# Altium schematic sheet E_Switch.SchDoc
size A3
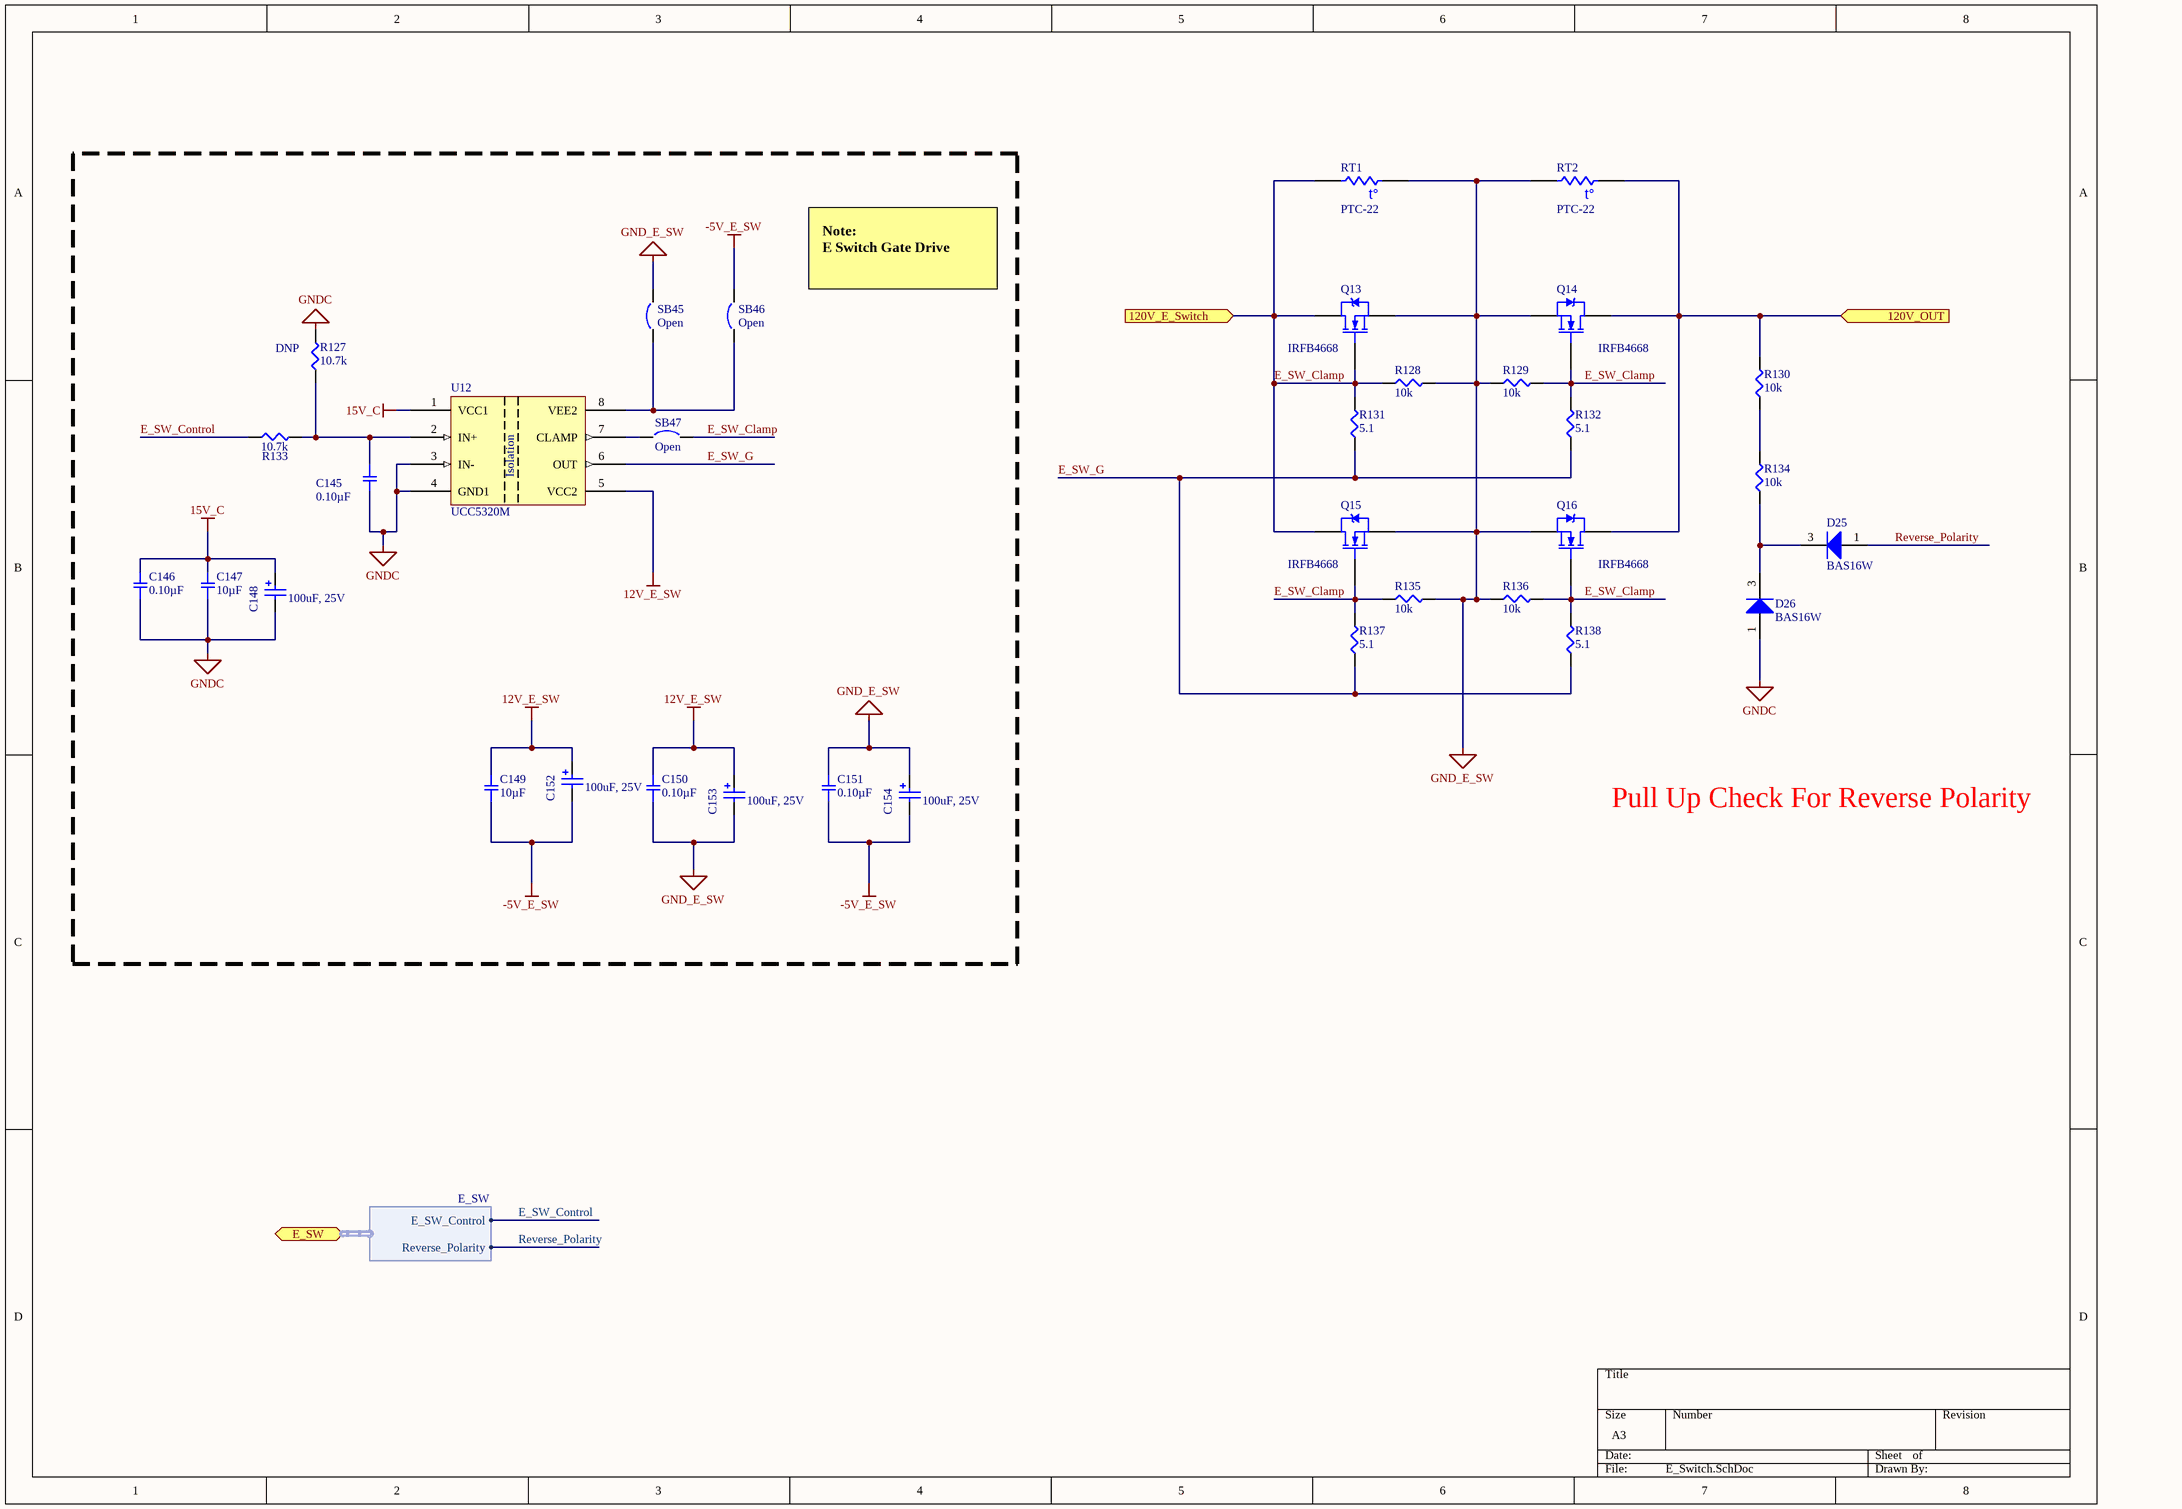
[diagram p0: E_Switch.SchDoc]

## Parts
C145  0.10µF  [SMD-0603C]
C146  0.10µF  [SMD-0805C]
C147  10µF  [SMD-0805C]
C148  100uF, 25V  [WCAP-ASLL_6.3x7.7]
C149  10µF  [SMD-0805C]
C150  0.10µF  [SMD-0805C]
C151  0.10µF  [SMD-0805C]
C152  100uF, 25V  [WCAP-ASLL_6.3x7.7]
C153  100uF, 25V  [WCAP-ASLL_6.3x7.7]
C154  100uF, 25V  [WCAP-ASLL_6.3x7.7]
D25  BAS16W  [SOT95P278X110-3N]
D26  BAS16W  [SOT95P278X110-3N]
Q13  IRFB4668  [TO-220AB]
Q14  IRFB4668  [TO-220AB]
Q15  IRFB4668  [TO-220AB]
Q16  IRFB4668  [TO-220AB]
R127  10.7k  [SMD-0603-RES]
R128  10k  [SMD-1206-RES]
R129  10k  [SMD-1206-RES]
R130  10k  [SMD-1206-RES]
R131  5.1  [SMD-1206-RES]
R132  5.1  [SMD-1206-RES]
R133  10.7k  [SMD-0603-RES]
R134  10k  [SMD-1206-RES]
R135  10k  [SMD-1206-RES]
R136  10k  [SMD-1206-RES]
R137  5.1  [SMD-1206-RES]
R138  5.1  [SMD-1206-RES]
RT1  PTC-22  [PTCEL-17R]
RT2  PTC-22  [PTCEL-17R]
SB45  Open  [Solder Bridge - HP]  (no BOM)
SB46  Open  [Solder Bridge - HP]  (no BOM)
SB47  Open  [Solder Bridge - HP]  (no BOM)
U12  UCC5320M  [SOIC127P570X175_HS-9N]

## Blocks framed on the sheet
DNP: C145-C154 R127 R133 SB45-SB47 U12

## Ports
120V_E_Switch (in), 120V_OUT (in), E_SW (bidir, harness E_SW)

## Harnesses
E_SW: E_SW_Control, Reverse_Polarity

## Nets
12V_E_SW: C149.2 C150.2 C152.2(P) C153.2(P) U12.5(VCC2)
15V_C: C146.2 C147.2 C148.2(P) U12.1(VCC1)
-5V_E_SW: C149.1 C151.1 C152.1(N) C154.1(N) SB46.2
GND_E_SW: C150.1 C151.2 C153.1(N) C154.2(P) Q13.3(S) Q14.3(S) Q15.3(S) Q16.3(S) R128.2 R129.1 R135.2 R136.1 RT1.1 RT2.2 SB45.2
GNDC: C145.2 C146.1 C147.1 C148.1(N) D26.1(A) R127.2 U12.3(IN-) U12.4(GND1)
120V_OUT: Q14.2(D) Q16.2(D) R130.2 RT2.1 ; port 120V_OUT
E_SW_Clamp: Q13.1(G) Q13.2(D) Q14.1(G) Q15.1(G) Q15.2(D) Q16.1(G) R128.1 R129.2 R131.2 R132.2 R135.1 R136.2 R137.2 R138.2 RT1.2 SB47.2 ; port 120V_E_Switch
E_SW_Control: R133.1 ; port E_SW.E_SW_Control
E_SW_G: R131.1 R132.1 R137.1 R138.1 U12.6(OUT)
Reverse_Polarity: D25.1(A) ; port E_SW.Reverse_Polarity
NetC145_1: C145.1 R127.1 R133.2 U12.2(IN+)
NetD25_3: D25.3(K) D26.3(K) R134.1
NetR130_1: R130.1 R134.2
NetSB45_1: SB45.1 SB46.1 U12.8(VEE2)
NetSB47_1: SB47.1 U12.7(CLAMP)

## Notes on the sheet
- Note:
  E Switch Gate Drive
- Pull Up Check For Reverse Polarity
- (in symbol Res Thermal) t°
- (in symbol UCC5320M) Isolation

## Library data of the parts
C145 = GCJ188R72A104KA01D: CAP CER 0.1UF 100V X7R 0603; Manufacturer: Murata Electronics North America; Factory Stock: 0; Unit Price (USD): 0.23; Minimum Quantity: 1; Tolerance: ±10%; Datasheets: http://www.murata.com/~/media/webrenewal/support/library/catalog/products/capacitor/mlcc/c03e.ashx; Image: //media.digikey.com/Renders/Murata%20Renders/0603%28LQG18%29.jpg; Digi-Key Part Number: 490-13420-1-ND; Part Number: GCJ188R72A104KA01D; Quantity Available: 2728; @ qty: 0; Packaging: Cut Tape (CT); Series: GCJ; Part Status: Active; Value: 0.10µF; Voltage: 100V; Temperature Coefficient: X7R; Operating Temperature: -55°C ~ 125°C; Features: Soft Termination; Ratings: AEC-Q200; Applications: Automotive, Boardflex Sensitive; Mounting Type: Surface Mount, MLCC; Package / Case: 0603 (1608 Metric); Size / Dimension: 0.063" L x 0.031" W (1.60mm x 0.80mm); Height - Seated (Max): -; Thickness (Max): 0.035" (0.90mm); Lead Spacing: -; Lead Style: -
C146 C150 C151 = GCD21BR71H104KA01L: CAP CER 0.1UF 50V X7R 0805; Manufacturer: Murata Electronics North America; Factory Stock: 0; Unit Price (USD): 0.24; Minimum Quantity: 1; Tolerance: ±10%; Datasheets: http://www.murata.com/~/media/webrenewal/support/library/catalog/products/capacitor/mlcc/c03e.ashx; Image: //media.digikey.com/Renders/Murata%20Renders/0805%28GxM6%29.jpg; Digi-Key Part Number: 490-11955-1-ND; Part Number: GCD21BR71H104KA01L; Quantity Available: 157; @ qty: 0; Packaging: Cut Tape (CT); Series: GCD; Part Status: Active; Value: 0.10µF; Voltage: 50V; Temperature Coefficient: X7R; Operating Temperature: -55°C ~ 125°C; Features: -; Ratings: AEC-Q200; Applications: Automotive; Mounting Type: Surface Mount, MLCC; Package / Case: 0805 (2012 Metric); Size / Dimension: 0.079" L x 0.049" W (2.00mm x 1.25mm); Height - Seated (Max): -; Thickness (Max): 0.049" (1.25mm); Lead Spacing: -; Lead Style: -
C147 C149 = GRM21BC8YA106KE11L: CAP CER 10UF 35V X6S 0805; Manufacturer: Murata Electronics North America; Factory Stock: 0; Unit Price (USD): 0.33; Minimum Quantity: 1; Tolerance: ±10%; Datasheets: http://www.murata.com/~/media/webrenewal/support/library/catalog/products/capacitor/mlcc/c02e.pdf; Image: //media.digikey.com/Renders/Murata%20Renders/0805%20(2012%20Metric)%20.85mm.jpg; Digi-Key Part Number: 490-10504-1-ND; Part Number: GRM21BC8YA106KE11L; Quantity Available: 72253; @ qty: 0; Packaging: Cut Tape (CT); Series: GRM; Part Status: Active; Value: 10µF; Voltage: 35V; Temperature Coefficient: X6S; Operating Temperature: -55°C ~ 105°C; Features: Derating Recommended; Ratings: -; Applications: General Purpose; Mounting Type: Surface Mount, MLCC; Package / Case: 0805 (2012 Metric); Size / Dimension: 0.079" L x 0.049" W (2.00mm x 1.25mm); Height - Seated (Max): -; Thickness (Max): 0.057" (1.45mm); Lead Spacing: -; Lead Style: -
C148 C152-C154 = 865060445005: WCAP-ASLL SMT Aluminum Electrolytic Capacitors, D6.3mm x L7.7mm, 100uF, +/-20%, 25VDC; Dissipation Factor: 14%; Endurance: 2000h; Leakage Current: 25uA; Ripple Current max.: 300mA; Technical Reference: ASED077101M025DVCTCB000; ComponentLink1Description: Manufacturer; ComponentLink1URL: http://www.we-online.de; ComponentLink2Description: Datasheet; ComponentLink2URL: https://katalog.we-online.com/pbs/datasheet/865060445005.pdf; Length: 7.7mm; Mounting Technology: SMT; Operating Temperature: -55 to +105degC; Packaging: Tape and Reel; Published Date: August 2019; Capacitance: 100uF; Diameter: 6.3mm; Part Number: 865060445005; Publisher: Wurth Elektronik; Capacitance Tolerance: +/-20%; Rated Voltage: 25VDC
D25 D26 = BAS16: Silicon Switching Diode, SOT323, Reel, Green; Manufacturer: Infineon; IR (max): 100Â nA; Configuration: Single; VBR (min): 85Â V; VR (max): 80Â V; trr (max): 4Â ns; Green: TRUE; VF (max): 1.25Â V; IF (max): 250Â mA; Mounting Technology: Surface Mount; PackageReference: SOT323; ComponentLink2URL: http://www.infineon.com/dgdl/bas16series.pdf?folderId=db3a30431400ef6801141b5844e103ea&fileId=db3a30431400ef6801141b93811b03ff; Halogen-free: TRUE; ComponentLink2Description: Datasheet; PartNumber: BAS16W; ComponentLink1Description: Manufacturer URL; ComponentLink3URL: http://www.infineon.com/dgdl/SOT323-Package_Overview.pdf?folderId=db3a30431936bc4b0119533e1dcb3c92&fileId=db3a30431936bc4b011953495f283cb1; ComponentLink1URL: http://www.infineon.com/; PackageDescription: 3-Pin Small Outline Transistor Package, 1.25 x 2 mm Body, 0.65 mm Pitch; ComponentLink3Description: Package Specification
Q13-Q16 = NMOS-2: N-Channel Power MOSFET; Note: Pin 2 is electrically connected to pin 4.; Published: 8-Jun-2000; LatestRevisionDate: 17-Jul-2002; LatestRevisionNote: Re-released for DXP Platform.; DatasheetVersion: PD-9.814; PackageVersion: Feb-1997; PackageReference: TO-220AB; Publisher: Altium Limited; PackageDescription: TO, Thru-Hole, Vertical, Heatsink Mounted; 3 In-Line Leads; Pitch 2.54 mm; ComponentLink1Description: Manufacturer Link; ComponentLink1URL: http://www.irf.com/
R127 R133 = ERJ-3EKF1072V: RES SMD 10.7K OHM 1% 1/10W 0603; Manufacturer: Panasonic Electronic Components; Factory Stock: 0; Unit Price (USD): 0.00379; @ qty: 1500; Minimum Quantity: 1; Power (Watts): 0.1W, 1/10W; Temperature Coefficient: ±100ppm/°C; Part Number: ERJ-3EKF1072V; Datasheets: http://industrial.panasonic.com/www-cgi/jvcr13pz.cgi?E+PZ+3+AOA0002+ERJ3EKF1072V+7+WW; Image: //media.digikey.com/Photos/Panasonic%20Photos/MFG_ERJ-P6W%20Series.jpg; Digi-Key Part Number: P10.7KHCT-ND; Quantity Available: 142624; Packaging: Cut Tape (CT); Series: ERJ; Part Status: Active; Value: 10.7k; Tolerance: ±1%; Composition: Thick Film; Features: Automotive AEC-Q200; Operating Temperature: -55°C ~ 155°C; Package / Case: 0603 (1608 Metric); Supplier Device Package: 0603; Size / Dimension: 0.063" L x 0.031" W (1.60mm x 0.80mm); Height - Seated (Max): 0.022" (0.55mm); Number of Terminations: 2; Failure Rate: -
R128-R130 R134-R136 = ERJ-8ENF1002V: RES SMD 10K OHM 1% 1/4W 1206; Manufacturer: Panasonic Electronic Components; Factory Stock: 0; Unit Price (USD): 0.00933; @ qty: 1500; Minimum Quantity: 1; Power (Watts): 0.25W, 1/4W; Temperature Coefficient: ±100ppm/°C; Part Number: ERJ-8ENF1002V; Datasheets: http://industrial.panasonic.com/www-cgi/jvcr13pz.cgi?E+PZ+3+AOA0002+ERJ8ENF1002V+7+WW; Image: //media.digikey.com/Renders/Panasonic%20Renders/ERJ-1206%20Pkg.jpg; Digi-Key Part Number: P10.0KFCT-ND; Quantity Available: 1108398; Packaging: Cut Tape (CT); Series: ERJ; Part Status: Active; Value: 10k; Tolerance: ±1%; Composition: Thick Film; Features: Automotive AEC-Q200; Operating Temperature: -55°C ~ 155°C; Package / Case: 1206 (3216 Metric); Supplier Device Package: 1206; Size / Dimension: 0.126" L x 0.063" W (3.20mm x 1.60mm); Height - Seated (Max): 0.028" (0.70mm); Number of Terminations: 2; Failure Rate: -
R131 R132 R137 R138 = ERJ-8BQF5R1V: RES SMD 5.1 OHM 1% 1/2W 1206; Manufacturer: Panasonic Electronic Components; Factory Stock: 0; Unit Price (USD): 0.05778; @ qty: 1500; Minimum Quantity: 1; Power (Watts): 0.5W, 1/2W; Temperature Coefficient: ±200ppm/°C; Part Number: ERJ-8BQF5R1V; Datasheets: https://industrial.panasonic.com/cdbs/www-data/pdf/RDA0000/AOA0000C239.pdf; Image: //media.digikey.com/Renders/Panasonic%20Renders/ERJ-1206%20Pkg.jpg; Digi-Key Part Number: P17617CT-ND; Quantity Available: 4802; Packaging: Cut Tape (CT); Series: ERJ; Part Status: Active; Value: 5.1; Tolerance: ±1%; Composition: Thick Film; Features: Automotive AEC-Q200, Current Sense; Operating Temperature: -55°C ~ 125°C; Package / Case: 1206 (3216 Metric); Supplier Device Package: 1206; Size / Dimension: 0.126" L x 0.063" W (3.20mm x 1.60mm); Height - Seated (Max): 0.028" (0.70mm); Number of Terminations: 2; Failure Rate: -
RT1 RT2 = Res Thermal: PTC Thermistor; Published: 24-Mar-1999; LatestRevisionDate: 29-May-2009; LatestRevisionNote: IPC-7351 Footprint Added.; PackageVersion: Mar-2003; PackageReference: 6-0805; Publisher: Altium Limited; PackageDescription: Chip Resistor 0805 Case Size; Code_IPC: RESC2012
SB45-SB47 = Solder Bridge: Circuit Breaker; Published: 24-Mar-1999; Revision: July-2002: Re-released for DXP Platform.; Publisher: Altium Limited
U12 = UCC5320M: Single-Channel Isolated Gate Drivers; Supplier 1: Digi-Key; Supplier Part Number 1: 296-49025-1-ND